# Altium project Handheld Teensy 3.6 Logger Rev3e.PrjPcb
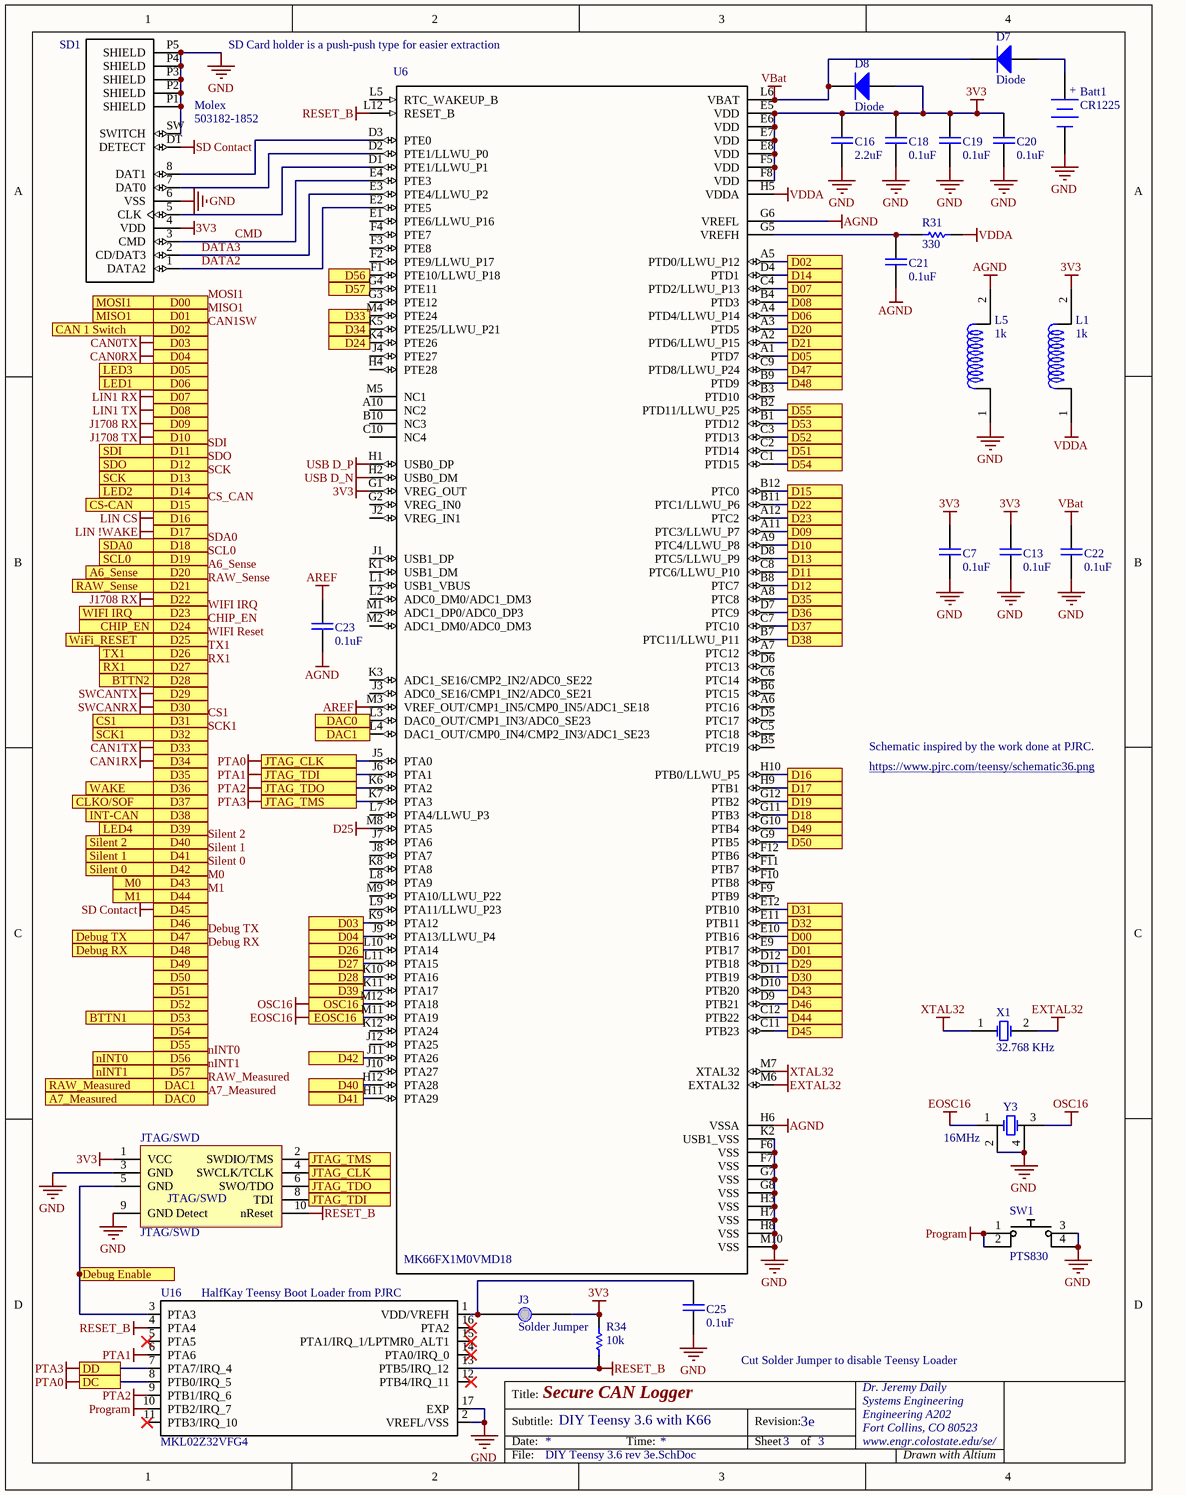
[diagram p0: DIY Teensy 3.6 rev 3e.SchDoc]
3 sheets, 116 parts. Net scope: flat (ports and power ports of the same name join across sheets).
Board file: CAN Logger 3e HP3651 PCB.PcbDoc
Sheets:
  DIY Teensy 3.6 rev 3e.SchDoc
  Teensy 3.6 with J1939 - Handheld Rev3e.SchDoc
  Additional Circuits - Handheld - Rev 3e.SchDoc

## Sheet DIY Teensy 3.6 rev 3e.SchDoc: Secure CAN Logger
size Letter portrait; Organization: Dr. Jeremy Daily; Address1: Systems Engineering; Address2: Engineering A202; Address3: Fort Collins, CO 80523; Address4: www.engr.colostate.edu/se/; DocumentNumber: DIY Teensy 3.6 with K66; Revision: 3e; SheetNumber: 3; SheetTotal: 3

### Parts
Batt1  CR1225  [Battery Clip - CR1225]
C7  0.1uF  [0603]
C13  0.1uF  [0603]
C16  2.2uF  [0603]
C18  0.1uF  [0603]
C19  0.1uF  [0603]
C20  0.1uF  [0603]
C21  0.1uF  [0603]
C22  0.1uF  [0603]
C23  0.1uF  [0603]
C25  0.1uF  [0603]
D7  Diode  [CST2C]
D8  Diode  [CST2C]
J3  Solder Jumper  [Solder Jumper]
JTAG/SWD  JTAG/SWD  [JTAG 10-pin Header]
L1  1k  [0603]
L5  1k  [0603]
R31  330  [0603]
R34  10k  [0603]
SD1  503182-1852  Manufacturer: Molex  [*MOLEX_503182-1852_503182-1852(Primary)]
SW1  PTS830  [Switch PTS830]
U6  MK66FX1M0VMD18  [*BGA144C100P12X12_1300X1300X170_MK66FX1M0VMD18(Primary)]
U16  MKL02Z32VFG4  [*QFN50P300X300X65-17N]
X1  32.768 KHz  [XTAL 2-pad Small]
Y3  16MHz  [XTAL 4 pad]

### Ports
A6_Sense, A7_Measured, BTTN1, BTTN2, CAN 1 Switch, CHIP_EN, CLKO/SOF, CS1, CS-CAN, D00, D01, D02, D03, D04, D05, D06, D07, D08, D09, D10, D11, D12, D13, D14, D15, D16, D17, D18, D19, D20, D21, D22, D23, D24, D25, D26, D27, D28, D29, D30, D31, D32, D33, D34, D35, D36, D37, D38, D39, D40, D41, D42, D43, D44, D45, D46, D47, D48, D49, D50, D51, D52, D53, D54, D55, D56, D57, DAC0, DAC1, DC, DD, Debug Enable, Debug RX, Debug TX, EOSC16, INT-CAN, JTAG_CLK, JTAG_TDI, JTAG_TDO, JTAG_TMS, LED1, LED2, LED3, LED4, M0, M1, MISO1, MOSI1, nINT0, nINT1, OSC16, RAW_Measured, RAW_Sense, RX1, SCK, SCK1, SCL0, SDA0, SDI, SDO, Silent 0, Silent 1, Silent 2, TX1, WAKE, WIFI IRQ, WiFi_RESET

### Nets
3V3: C7.2 C13.2 C16.2 C18.2 C19.2 C20.2 D8.1(A) J3.2 JTAG/SWD.1(VCC) L1.2 R34.1 SD1.4(VDD) U6.E5(VDD) U6.E6(VDD) U6.E7(VDD) U6.E8(VDD) U6.F5(VDD) U6.F8(VDD) U6.G1(VREG_OUT)
AGND: C21.1 C23.1 L5.2 U6.G6(VREFL) U6.H6(VSSA)
AREF: C23.2 U6.M3(VREF_OUT/CMP1_IN5/CMP0_IN5/ADC1_SE18)
CAN0RX: U6.J9(PTA13/LLWU_P4) ; port D04
CAN0TX: U6.K9(PTA12) ; port D03
CAN1RX: U6.K5(PTE25/LLWU_P21) ; port D34
CAN1TX: U6.M4(PTE24) ; port D33
D25: U6.M8(PTA5)
EOSC16: U6.M11(PTA19) Y3.1(OSC1) ; port EOSC16
EXTAL32: U6.M6(EXTAL32) X1.2(OSC2)
GND: Batt1.2(-) C7.1 C13.1 C16.1 C18.1 C19.1 C20.1 C22.1 C25.1 JTAG/SWD.3(GND) JTAG/SWD.9(GND_Detect) L5.1 SD1.6(VSS) SD1.P1(SHIELD) SD1.P2(SHIELD) SD1.P3(SHIELD) SD1.P4(SHIELD) SD1.P5(SHIELD) SD1.SW(SWITCH) SW1.3 SW1.4 U6.F6(VSS) U6.F7(VSS) U6.G7(VSS) U6.G8(VSS) U6.H3(VSS) U6.H7(VSS) U6.H8(VSS) U6.K2(USB1_VSS) U6.M10(VSS) U16.2(VREFL/VSS) U16.17(EXP) Y3.2(OSC2) Y3.4(GND)
J1708 RX: U6.A11(PTC3/LLWU_P7) U6.B11(PTC1/LLWU_P6) ; port D09, port D22
J1708 TX: U6.A9(PTC4/LLWU_P8) ; port D10
LIN1 RX: U6.C4(PTD2/LLWU_P13) ; port D07
LIN1 TX: U6.B4(PTD3) ; port D08
LIN !WAKE: U6.H9(PTB1) ; port D17
LIN CS: U6.H10(PTB0/LLWU_P5) ; port D16
OSC16: U6.M12(PTA18) Y3.3(OSC2) ; port OSC16
Program: SW1.1 SW1.2 U16.10(PTB2/IRQ_7)
PTA0: JTAG/SWD.4(SWCLK/TCLK) U6.J5(PTA0) U16.8(PTB0/IRQ_5) ; port DC, port JTAG_CLK
PTA1: JTAG/SWD.8(TDI) U6.J6(PTA1) U16.6(PTA6) ; port JTAG_TDI
PTA2: JTAG/SWD.6(SWO/TDO) U6.K6(PTA2) U16.9(PTB1/IRQ_6) ; port JTAG_TDO
PTA3: JTAG/SWD.2(SWDIO/TMS) U6.K7(PTA3) U16.7(PTA7/IRQ_4) ; port DD, port JTAG_TMS
RESET_B: JTAG/SWD.10(nReset) R34.2 U6.L12(RESET_B) U16.4(PTA4) U16.13(PTB5/IRQ_12)
SD Contact: SD1.DT(DETECT) U6.C11(PTB23) ; port D45
SWCANRX: U6.D11(PTB19) ; port D30
SWCANTX: U6.D12(PTB18) ; port D29
USB D_N: U6.H2(USB0_DM)
USB D_P: U6.H1(USB0_DP)
VBat: C22.2 D7.2(K) D8.2(K) U6.L6(VBAT)
VDDA: L1.1 R31.1 U6.H5(VDDA)
XTAL32: U6.M7(XTAL32) X1.1(OSC1)
A6_Sense: U6.A3(PTD5) ; port A6_Sense, port D20
A7_Measured: U6.L3(DAC0_OUT/CMP1_IN3/ADC0_SE23) ; port A7_Measured, port DAC0
Blue: U6.K11(PTA17) ; port LED4, port D39
BTTN1: U6.B1(PTD12) ; port BTTN1, port D53
BTTN2: U6.K10(PTA16) ; port BTTN2, port D28
CAN1SW: U6.A5(PTD0/LLWU_P12) ; port CAN 1 Switch, port D02
CHIP_EN: U6.K4(PTE26) ; port CHIP_EN, port D24
CMD: SD1.3(CMD) U6.E4(PTE3)
CS1: U6.E12(PTB10) ; port CS1, port D31
CS_CAN: U6.B12(PTC0) ; port CS-CAN, port D15
DATA2: SD1.1(DATA2) U6.E2(PTE5)
DATA3: SD1.2(CD/DAT3) U6.E3(PTE4/LLWU_P2)
Debug RX: U6.B9(PTD9) ; port Debug RX, port D48
Debug TX: U6.C9(PTD8/LLWU_P24) ; port Debug TX, port D47
Green: U6.A4(PTD4/LLWU_P14) ; port LED1, port D06
M0: U6.D10(PTB20) ; port M0, port D43
M1: U6.C12(PTB22) ; port M1, port D44
MISO1: U6.E9(PTB17) ; port MISO1, port D01
MOSI1: U6.E10(PTB16) ; port MOSI1, port D00
nINT0: U6.F1(PTE10/LLWU_P18) ; port nINT0, port D56
nINT1: U6.G4(PTE11) ; port nINT1, port D57
RAW_Measured: U6.L4(DAC1_OUT/CMP0_IN4/CMP2_IN3/ADC1_SE23) ; port RAW_Measured, port DAC1
RAW_Sense: U6.A2(PTD6/LLWU_P15) ; port RAW_Sense, port D21
RED: U6.D4(PTD1) ; port LED2, port D14
RX1: U6.L11(PTA15) ; port RX1, port D27
SCK: U6.D8(PTC5/LLWU_P9) ; port SCK, port D13
SCK1: U6.E11(PTB11) ; port SCK1, port D32
SCL0: U6.G12(PTB2) ; port SCL0, port D19
SDA0: U6.G11(PTB3) ; port SDA0, port D18
SDI: U6.C8(PTC6/LLWU_P10) ; port SDI, port D11
SDO: U6.B8(PTC7) ; port SDO, port D12
Silent 0: U6.J11(PTA26) ; port Silent 0, port D42
Silent 1: U6.H11(PTA29) ; port Silent 1, port D41
Silent 2: U6.H12(PTA28) ; port Silent 2, port D40
TX1: U6.L10(PTA14) ; port TX1, port D26
WIFI IRQ: U6.A12(PTC2) ; port WIFI IRQ, port D23
WIFI Reset: port WiFi_RESET, port D25
Yellow: U6.A1(PTD7) ; port LED3, port D05
NetBatt1_1: Batt1.1(+) D7.1(A)
NetC21_2: C21.2 R31.2 U6.G5(VREFH)
NetC25_2: C25.2 J3.1 U16.1(VDD/VREFH)
NetJTAG/SWD_5: JTAG/SWD.5(GND) U16.3(PTA3) ; port Debug Enable
NetSD1_5: SD1.5(CLK) U6.D1(PTE1/LLWU_P1)
NetSD1_7: SD1.7(DAT0) U6.D2(PTE1/LLWU_P0)
NetSD1_8: SD1.8(DAT1) U6.D3(PTE0)
NetU6_A8: U6.A8(PTC8) ; port D35
NetU6_B2: U6.B2(PTD11/LLWU_P25) ; port D55
NetU6_B7: U6.B7(PTC11/LLWU_P11) ; port INT-CAN, port D38
NetU6_C1: U6.C1(PTD15) ; port D54
NetU6_C2: U6.C2(PTD14) ; port D51
NetU6_C3: U6.C3(PTD13) ; port D52
NetU6_C7: U6.C7(PTC10) ; port CLKO/SOF, port D37
NetU6_D7: U6.D7(PTC9) ; port WAKE, port D36
NetU6_D9: U6.D9(PTB21) ; port D46
NetU6_G9: U6.G9(PTB5) ; port D50
NetU6_G10: U6.G10(PTB4) ; port D49

Not connected (* = marked no-connect by the designer): U6 A6(PTC16) A7(PTC12) A10(NC2) B3(PTD10) B5(PTC19) B6(PTC15) B10(NC3) C5(PTC18) C6(PTC14) C10(NC4) D5(PTC17) D6(PTC13) E1(PTE6/LLWU_P16) F2(PTE9/LLWU_P17) F3(PTE8) F4(PTE7) F9(PTB9) F10(PTB8) F11(PTB7) F12(PTB6) G2(VREG_IN0) G3(PTE12) H4(PTE28) J1(USB1_DP) J2(VREG_IN1) J3(ADC0_SE16/CMP1_IN2/ADC0_SE21) J4(PTE27) J7(PTA6) J8(PTA7) J10(PTA27) J12(PTA25) K1(USB1_DM) K3(ADC1_SE16/CMP2_IN2/ADC0_SE22) K8(PTA8) K12(PTA24) L1(USB1_VBUS) L2(ADC0_DM0/ADC1_DM3) L5(RTC_WAKEUP_B) L7(PTA4/LLWU_P3) L8(PTA9) L9(PTA11/LLWU_P23) M1(ADC1_DP0/ADC0_DP3) M2(ADC1_DM0/ADC0_DM3) M5(NC1) M9(PTA10/LLWU_P22); U16 5(PTA5)* 11(PTB3/IRQ_10)* 12(PTB4/IRQ_11)* 14(PTA0/IRQ_0)* 15(PTA1/IRQ_1/LPTMR0_ALT1)* 16(PTA2)*

### Notes on the sheet
- SD Card holder is a push-push type for easier extraction
- Schematic inspired by the work done at PJRC.
- https://www.pjrc.com/teensy/schematic36.png
- (near U16) HalfKay Teensy Boot Loader from PJRC
- Cut Solder Jumper to disable Teensy Loader
- Title:
- Subtitle:
- Date:
- Time:
- Revision:
- Sheet
- of
- File:
- Drawn with Altium

### Library data of the parts
Batt1 = CR2032 Battery Holder: Lithium Battery Non-Rechargeable (Primary) 3V Coin, 12.5mm; Manufacturer: Linx; PartNumber: BAT-HLD-012-SMT; Supplier 1: Digi-Key; Supplier Part Number 1: BAT-HLD-012-SMT-ND
C7 C13 C18-C23 C25 = Cap: CAP CER 0.1UF 50V X7R 0603; Manufacturer: KEMET; PartNumber: C0603C104K5RACAUTO; Alternative: Acceptable; Supplier 1: Digi-Key; Supplier Part Number 1: 399-6856-1-ND
C16 = Cap: 2.2µF ±10% 6.3V Ceramic Capacitor X5R 0603 (1608 Metric); Manufacturer: Taiyo Yuden; PartNumber: JMK107BJ225KAHT; Alternative: Acceptable; Supplier 1: Digi-Key; Supplier Part Number 1: 587-3386-1-ND
D7 D8 = Diode: Default Diode; Manufacturer: Toshiba Semiconductor and Storage; PartNumber: CCS15S30L3FCT-ND; Supplier 1: Digi-Key; Supplier Part Number 1: CCS15S30L3FCT-ND
JTAG/SWD = JTAG Cortex: Connector Header Surface Mount 10 position 0.050" (1.27mm); Manufacturer: CNC Tech; PartNumber: 3221-10-0300-00; Supplier 1: Digi-Key; Supplier Part Number 1: 1175-1735-ND
L1 L5 = Ferrite Bead: 1 kOhms @ 100MHz 1 Power Line Ferrite Bead 0603 (1608 Metric) 1A 200mOhm; Manufacturer: Murata; PartNumber: BLM18KG102SN1D; Alternative: Acceptable; Supplier 1: Digi-Key; Supplier Part Number 1: 490-17349-1-ND
R31 = Chip Resistor: 330 Ohms ±1% 0.1W, 1/10W Chip Resistor 0603 (1608 Metric) Automotive AEC-Q200, High Voltage Thick Film; Manufacturer: Rohm Semiconductor; PartNumber: KTR03EZPF3300; Alternative: Acceptable; Supplier 1: Digi-Key; Supplier Part Number 1: RHM330AYCT-ND
R34 = Chip Resistor: 10 kOhms ±1% 0.1W, 1/10W Chip Resistor 0603 (1608 Metric) Automotive AEC-Q200, High Voltage Thick Film; Manufacturer: Rohm Semiconductor; PartNumber: KTR03EZPF1002; Alternative: Acceptable; Supplier 1: Digi-Key; Supplier Part Number 1: RHM10.0KAYCT-ND
SD1 = 503182-1852: MICRO SD NORMAL ULTRALOWPRO8CKTE; PartNumber: 5031821852; Supplier Part Number 1: WM12834CT-ND; Supplier 1: Digi-Key
SW1 = Switch - Tactile_2: Tactile Switch SPST-NO Top Actuated Surface Mount; Manufacturer: C & K Components; PartNumber: PTS830GM140 SMTR LFS; Supplier 1: Digi-Key; Supplier Part Number 1: CKN10587CT-ND
U6 = MK66FX1M0VMD18: Kinetis K66: 180MHz Cortex-M4F MCU, 1.2MB Flash, 256KB SRAM, 2xUSB, Ethernet, 144-MAPBGA; Manufacturer: NXP USA Inc.; PartNumber: MK66FX1M0VMD18; Supplier 1: Digi-Key; Supplier Part Number 1: 568-13335-ND
U16 = MKL02Z32VFG4: 32 Bit Microcontroller, Kinetis L Series Ultra Low Power, ARM Cortex-M0+, 48 MHz, 32 KB, 4 KB, 16; Manufacturer: PJRC; PartNumber: Pre Programmed MKL02Z32VFG4; Alternative: Sole Source; Supplier 1: PJRC; Supplier Part Number 1: IC_MKL02Z32_QFN16
X1 = Crystal Oscillator: Canned Oscillator; Manufacturer: ECS Inc.; PartNumber: ECS-.327-CDX-1128; Supplier 1: Digi-Key; Supplier Part Number 1: XC2190CT-ND
Y3 = Crystal with Ground: 16MHz ±30ppm Crystal 18pF 80 Ohms 4-SMD, No Lead; Manufacturer: ECS Inc.; PartNumber: XC2866CT-ND; Supplier Part Number 1: XC2866CT-ND; Supplier 1: Digi-Key

## Sheet Teensy 3.6 with J1939 - Handheld Rev3e.SchDoc: Secure CAN Logger
size Letter; Organization: Dr. Jeremy Daily; Address1: Systems Engineering; Address2: Engineering A202; Address3: Fort Collins , CO 80523; Address4: www.engr.colostate.edu/se/; DocumentNumber: External Connections; Revision: 3e; SheetNumber: 1; SheetTotal: 3
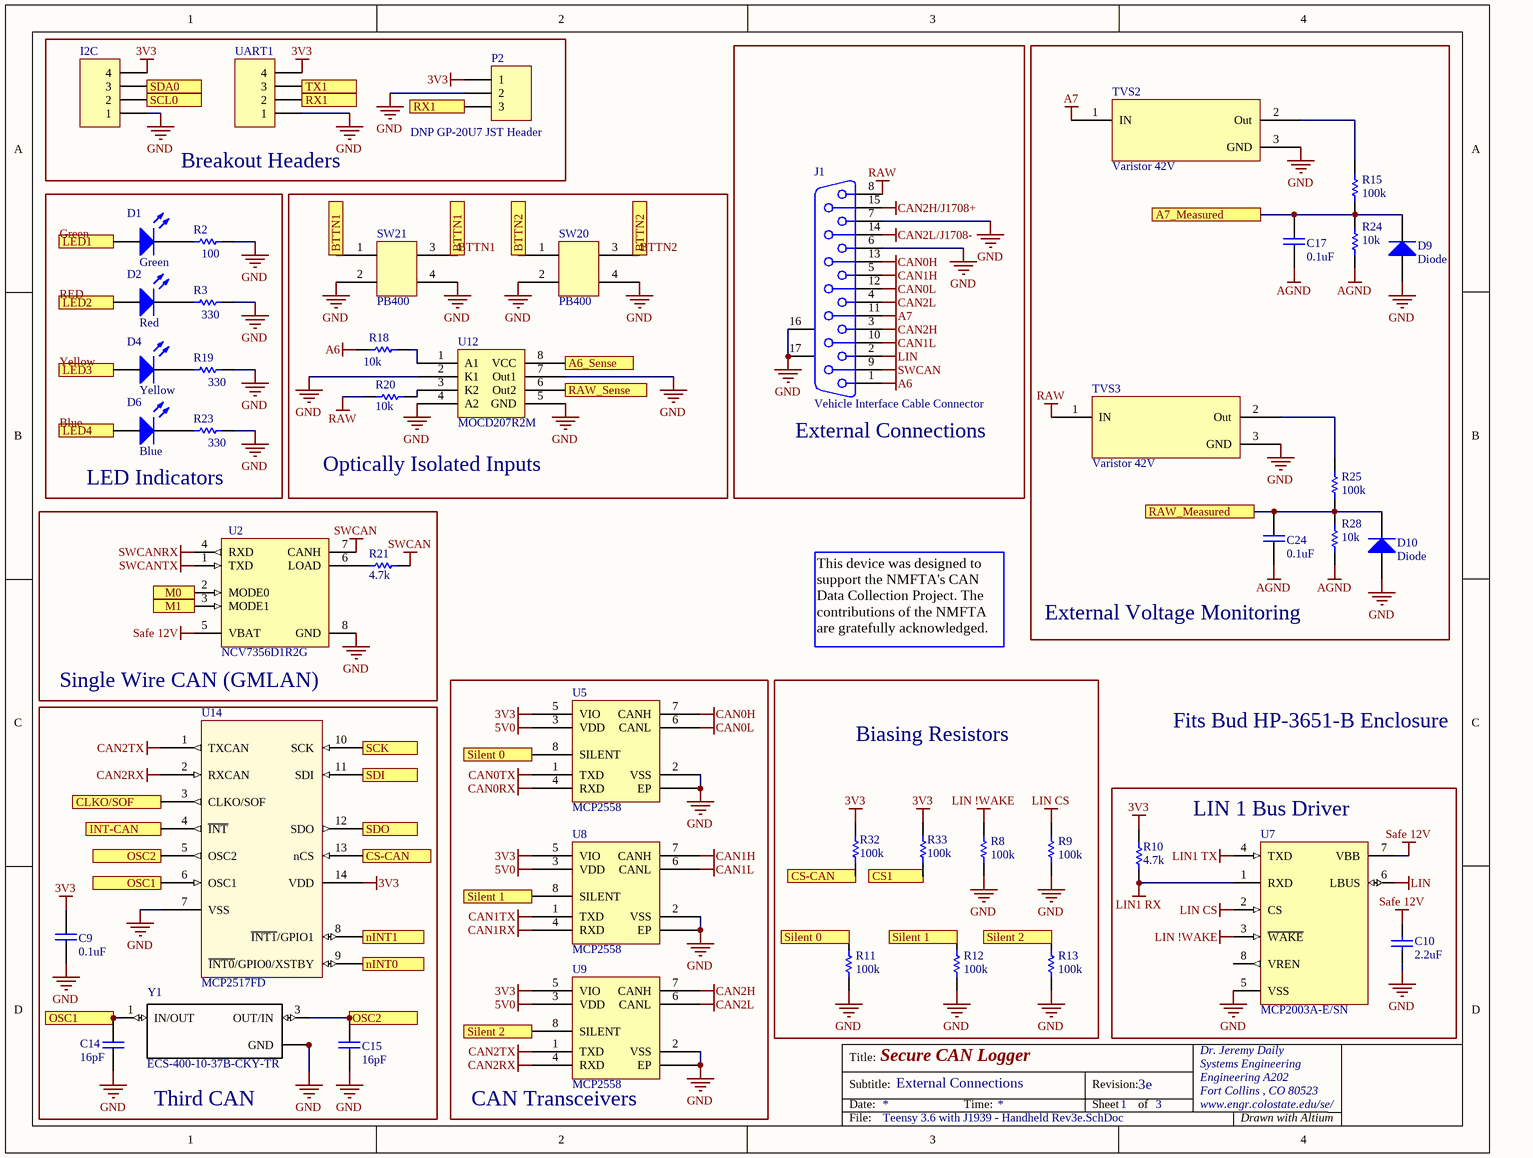
[diagram p1: Teensy 3.6 with J1939 - Handheld Rev3e.SchDoc]

### Parts
C9  0.1uF  [0603]
C10  2.2uF  [0603]
C14  16pF  [0603]
C15  16pF  [0603]
C17  0.1uF  [0603]
C24  0.1uF  [0603]
D1  Green  [0805 Polarized]
D2  Red  [0805 Polarized]
D4  Yellow  [0805 Polarized]
D6  Blue  [0805 Polarized]
D9  Diode  [CST2C]
D10  Diode  [CST2C]
I2C  Header 4  [HDR1X4]  (value not drawn)
J1  Vehicle Interface Cable Connector  [DSUB1.385-2H15]
P2  DNP GP-20U7 JST Header  [MHDR1X3]
R2  100  [0603]
R3  330  [0603]
R8  100k  [0603]
R9  100k  [0603]
R10  4.7k  [0603]
R11  100k  [0603]
R12  100k  [0603]
R13  100k  [0603]
R15  100k  [0603]
R18  10k  [0603]
R19  330  [0603]
R20  10k  [0603]
R21  4.7k  [0603]
R23  330  [0603]
R24  10k  [0603]
R25  100k  [0603]
R28  10k  [0603]
R32  100k  [0603]
R33  100k  [0603]
SW20  PB400  [PB400]
SW21  PB400  [PB400]
TVS2  Varistor 42V  [Transfeed]
TVS3  Varistor 42V  [Transfeed]
U2  NCV7356D1R2G  [ONSC-SOIC-8-751-07_V]
U5  MCP2558  [TDFN]
U7  MCP2003A-E/SN  [SOIC-SN8_N]
U8  MCP2558  [TDFN]
U9  MCP2558  [TDFN]
U12  MOCD207R2M  [SOIC-8]
U14  MCP2517FD  [SOP14]
UART1  Header 4  [HDR1X4]  (value not drawn)
Y1  ECS-400-10-37B-CKY-TR  [*XTAL_ECS-160-9-37-CKM-TR]

### Blocks framed on the sheet
Breakout Headers: I2C P2 UART1
External Connections: J1
External Voltage Monitoring: C17 C24 D9 D10 R15 R24 R25 R28 TVS2 TVS3
LED Indicators: D1 D2 D4 D6 R2 R3 R19 R23
Optically Isolated Inputs: R18 R20 SW20 SW21 U12
Single Wire CAN (GMLAN): R21 U2
CAN Transceivers: U5 U8 U9
Biasing Resistors: R8 R9 R11-R13 R32 R33
Third CAN: C9 C14 C15 U14 Y1
LIN 1 Bus Driver: C10 R10 U7

### Ports
A6_Sense, A7_Measured, BTTN1, BTTN2, CLKO/SOF, CS1, CS-CAN, INT-CAN, LED1, LED2, LED3, LED4, M0, M1, nINT0, nINT1, OSC1, OSC2, RAW_Measured, RAW_Sense, RX1, SCK, SCL0, SDA0, SDI, SDO, Silent 0, Silent 1, Silent 2, TX1

### Nets
3V3: C9.2 I2C.4 P2.1 R10.2 R32.2 R33.2 U5.5(VIO) U8.5(VIO) U9.5(VIO) U14.14(VDD) UART1.4
5V0: U5.3(VDD) U8.3(VDD) U9.3(VDD)
A6: J1.1 R18.1
A7: J1.11 TVS2.1(IN)
AGND: C17.1 C24.1 R24.2 R28.2
CAN0H: J1.13 U5.7(CANH)
CAN0L: J1.12 U5.6(CANL)
CAN0RX: U5.4(RXD)
CAN0TX: U5.1(TXD)
CAN1H: J1.5 U8.7(CANH)
CAN1L: J1.10 U8.6(CANL)
CAN1RX: U8.4(RXD)
CAN1TX: U8.1(TXD)
CAN2H: J1.3 U9.7(CANH)
CAN2H/J1708+: J1.15
CAN2L: J1.4 U9.6(CANL)
CAN2L/J1708-: J1.14
CAN2RX: U9.4(RXD) U14.2(RXCAN)
CAN2TX: U9.1(TXD) U14.1(TXCAN)
GND: C9.1 C10.2 C14.1 C15.1 D9.1(A) D10.1(A) I2C.1 J1.6 J1.7 J1.16(MH1) J1.17(MH2) P2.2 R2.2 R3.2 R8.2 R9.2 R11.2 R12.2 R13.2 R19.2 R23.2 SW20.2 SW20.4 SW21.2 SW21.4 TVS2.3(GND) TVS3.3(GND) U2.8(GND) U5.0(EP) U5.2(VSS) U7.5(VSS) U8.0(EP) U8.2(VSS) U9.0(EP) U9.2(VSS) U12.2(K1) U12.4(A2) U12.5(GND) U12.7(Out1) U14.7(VSS) UART1.1 Y1.2(GND) Y1.4(GND)
LIN: J1.2 U7.6(LBUS)
LIN1 RX: R10.1 U7.1(RXD)
LIN1 TX: U7.4(TXD)
LIN !WAKE: R8.1 U7.3(~{WAKE})
LIN CS: R9.1 U7.2(CS)
RAW: J1.8 R20.1 TVS3.1(IN)
Safe 12V: C10.1 U2.5(VBAT) U7.7(VBB)
SWCAN: J1.9 R21.2 U2.7(CANH)
SWCANRX: U2.4(RXD)
SWCANTX: U2.1(TXD)
A6_Sense: U12.8(VCC) ; port A6_Sense
A7_Measured: C17.2 D9.2(K) R15.2 R24.1 ; port A7_Measured
Blue: D6.1(A) ; port LED4
BTTN1: SW21.1 SW21.3 ; port BTTN1
BTTN2: SW20.1 SW20.3 ; port BTTN2
CS1: R33.1 ; port CS1
CS_CAN: R32.1 U14.13(nCS) ; port CS-CAN
Green: D1.1(A) ; port LED1
M0: U2.2(MODE0) ; port M0
M1: U2.3(MODE1) ; port M1
nINT0: U14.9(~{INT0}/GPIO0/XSTBY) ; port nINT0
nINT1: U14.8(~{INT1}/GPIO1) ; port nINT1
RAW_Measured: C24.2 D10.2(K) R25.2 R28.1 ; port RAW_Measured
RAW_Sense: U12.6(Out2) ; port RAW_Sense
RED: D2.1(A) ; port LED2
RX1: P2.3 UART1.2 ; port RX1
SCK: U14.10(SCK) ; port SCK
SCL0: I2C.2 ; port SCL0
SDA0: I2C.3 ; port SDA0
SDI: U14.11(SDI) ; port SDI
SDO: U14.12(SDO) ; port SDO
Silent 0: R11.1 U5.8(SILENT) ; port Silent 0
Silent 1: R12.1 U8.8(SILENT) ; port Silent 1
Silent 2: R13.1 U9.8(SILENT) ; port Silent 2
TX1: UART1.3 ; port TX1
Yellow: D4.1(A) ; port LED3
NetC14_2: C14.2 U14.6(OSC1) Y1.1(IN/OUT) ; port OSC1
NetC15_2: C15.2 U14.5(OSC2) Y1.3(OUT/IN) ; port OSC2
NetD1_2: D1.2(K) R2.1
NetD2_2: D2.2(K) R3.1
NetD4_2: D4.2(K) R19.1
NetD6_2: D6.2(K) R23.1
NetR15_1: R15.1 TVS2.2(Out)
NetR18_2: R18.2 U12.1(A1)
NetR20_2: R20.2 U12.3(K2)
NetR21_1: R21.1 U2.6(LOAD)
NetR25_1: R25.1 TVS3.2(Out)
NetU6_B7: U14.4(~{INT}) ; port INT-CAN
NetU6_C7: U14.3(CLKO/SOF) ; port CLKO/SOF

Not connected (* = marked no-connect by the designer): U7 8(VREN)

### Notes on the sheet
- This device was designed to support the NMFTA's CAN Data Collection Project. The contributions of the NMFTA are gratefully acknowledged.
- Fits Bud HP-3651-B Enclosure
- Title:
- Subtitle:
- Date:
- Time:
- Revision:
- Sheet
- of
- File:
- Drawn with Altium

### Library data of the parts
C9 C17 C24 = Cap: as C7 on sheet DIY Teensy 3.6 rev 3e; Supplier 1: Digi-Key; Supplier Part Number 1: 399-6856-1-ND
C10 = Cap: as C16 on sheet DIY Teensy 3.6 rev 3e; Supplier 1: Digi-Key; Supplier Part Number 1: 587-3386-1-ND
C14 C15 = Cap: 16pF ±5% 50V Ceramic Capacitor C0G, NP0 0603 (1608 Metric); Manufacturer: Yageo; PartNumber: CC0603JRNPO9BN160; Alternative: Acceptable; Supplier 1: Digi-Key; Supplier Part Number 1: 311-3964-1-ND
D1 = LED - SMD: Green 570nm LED Indication - Discrete 2.2V 0805 (2012 Metric); Manufacturer: OSRAM Opto Semiconductors Inc.; PartNumber: LG R971-KN-1; Supplier 1: Digi-Key; Supplier Part Number 1: 475-1410-1-ND
D2 = LED - SMD: Red 633nm LED Indication - Discrete 2V 0805 (2012 Metric); Manufacturer: OSRAM Opto Semiconductors Inc.; PartNumber: LS R976-NR-1; Supplier 1: Digi-Key; Supplier Part Number 1: 475-1278-1-ND
D4 = LED - SMD: LED YELLOW DIFFUSED 0805 SMD; Manufacturer: OSRAM Opto Semiconductors Inc.; PartNumber: LY R976-PS-36; Supplier 1: Digi-Key; Supplier Part Number 1: 475-2560-1-ND
D6 = LED - SMD: Blue 470nm LED Indication - Discrete 3.3V 0805 (2012 Metric); Manufacturer: Broadcom Limited; PartNumber: HSMN-C170; Supplier 1: Digi-Key; Supplier Part Number 1: 516-1437-1-ND
D9 D10 = Diode: as D7 on sheet DIY Teensy 3.6 rev 3e; Supplier 1: Digi-Key; Supplier Part Number 1: CCS15S30L3FCT-ND
I2C UART1 = Header 4: Header, 4-Pin
J1 = D Connector 15: Receptacle Assembly, 15 Position, Right Angle; Manufacturer: Amphenol FCI; PartNumber: D15S33E4GV00LF; Supplier 1: Digi-Key; Supplier Part Number 1: 609-1498-ND
P2 = MHDR1X3: CONN HEADER PH SIDE 3POS 2MM SMD; PartNumber: S3B-PH-SM4-TB(LF)(SN); Manufacturer: JST; Supplier 1: Digi-Key; Supplier Part Number 1: 455-1750-1-ND
R2 = Chip Resistor: 100 Ohms ±1% 0.1W, 1/10W Chip Resistor 0603 (1608 Metric) Automotive AEC-Q200, High Voltage Thick Film; Manufacturer: Rohm Semiconductor; PartNumber: KTR03EZPF1000; Alternative: Acceptable; Supplier 1: Digi-Key; Supplier Part Number 1: RHM100AYCT-ND
R3 R19 R23 = Chip Resistor: as R31 on sheet DIY Teensy 3.6 rev 3e; Supplier 1: Digi-Key; Supplier Part Number 1: RHM330AYCT-ND
R8 R9 R11-R13 R15 R25 R32 R33 = Chip Resistor: 100 kOhms ±1% 0.1W, 1/10W Chip Resistor 0603 (1608 Metric) Automotive AEC-Q200, High Voltage Thick Film; Manufacturer: Rohm Semiconductor; PartNumber: KTR03EZPF1003; Alternative: Acceptable; Supplier 1: Digi-Key; Supplier Part Number 1: RHM100KAYCT-ND
R10 R21 = Chip Resistor: 4.7 kOhms ±1% 0.1W, 1/10W Chip Resistor 0603 (1608 Metric) Automotive AEC-Q200, High Voltage Thick Film; Manufacturer: Rohm Semiconductor; PartNumber: KTR03EZPF4701; Alternative: Acceptable; Supplier 1: Digi-Key; Supplier Part Number 1: RHM4.7KAYCT-ND
R18 R20 R24 R28 = Chip Resistor: as R34 on sheet DIY Teensy 3.6 rev 3e; Supplier 1: Digi-Key; Supplier Part Number 1: RHM10.0KAYCT-ND
SW20 SW21 = PB400: Pushbutton Switch DPST-NO Standard Through Hole, Right Angle; Manufacturer: E-Switch; PartNumber: PB400OAQR1BLK; Supplier 1: Digi-Key; Supplier Part Number 1: EG5548-ND
TVS2 TVS3 = Transfeed: VARISTOR CAP FEEDTHRU 18V 0805; Manufacturer: AVX; PartNumber: V2F118A400Y2EDP; Supplier 1: Digi-Key; Supplier Part Number 1: 478-2485-1-ND
U2 = NCV7356D1G: Single Wire CAN Transceiver, 5 to 27 V, 8-Pin SOIC, Pb-Free, Tube; Manufacturer: On Semiconductor; Supplier 1: Digi-Key; Supplier Part Number 1: NCV7356D1R2GOSCT-ND; PartNumber: NCV7356D1R2G
U5 = MCP2558FD: Microchip CAN FD Transceiver with Silent Mode; Manufacturer: Microchip Technology; PartNumber: MCP2558FDT-H/MNY; Supplier 1: Digi-Key; Supplier Part Number 1: MCP2558FDT-H/MNYCT-ND
U7 = MCP2003AT-E/SN: LIN J2602 Transceiver, 8-Pin SOIC, Extended Temperature, Tape and Reel; Manufacturer: Microchip Technology; Supplier 1: Digi-Key; Supplier Part Number 1: MCP2003A-E/SN-ND; PartNumber: MCP2003A-E/SN
U8 U9 = MCP2558FD: Microchip CAN FD Transceiver with Silent Mode; PartNumber: MCP2558FDT-H/MNY; Manufacturer: Microchip; Supplier 1: Digi-Key; Supplier Part Number 1: MCP2558FDT-H/MNYCT-ND
U12 = Optoisolator - Dual: Optoisolator Transistor Output 2500Vrms 2 Channel 8-SO Tall; Manufacturer: Fairchild/ON Semiconductor; PartNumber: MOCD207R2M; Supplier 1: Digi-Key; Supplier Part Number 1: MOCD207R2MCT-ND
U14 = MCP2517FD: CANbus Controller CAN 2.0 SPI Interface 14-VDFN (4.5x3); Manufacturer: Microchip Technology; PartNumber: MCP2517FDT-H/JHA; Supplier 1: Digi-Key; Supplier Part Number 1: MCP2517FDT-H/JHACT-ND
Y1 = ECS-400-10-37B-CKY-TR: Manufacturer: ECS Inc.; PartNumber: ECS-400-10-37B-CKY-TR; Supplier 1: Digi-Key; Supplier Part Number 1: XC3069CT-ND

## Sheet Additional Circuits - Handheld - Rev 3e.SchDoc: Secure Handheld J1939 Logger
size Letter; Organization: Dr. Jeremy Daily; Address1: Systems Engineering; Address2: Engineering A202; Address3: Fort Collins, CO 80523; Address4: www.engr.colostate.edu/se/; DocumentNumber: Wifi, J1708, USB, and Security; Revision: 3e; SheetNumber: 2; SheetTotal: 3
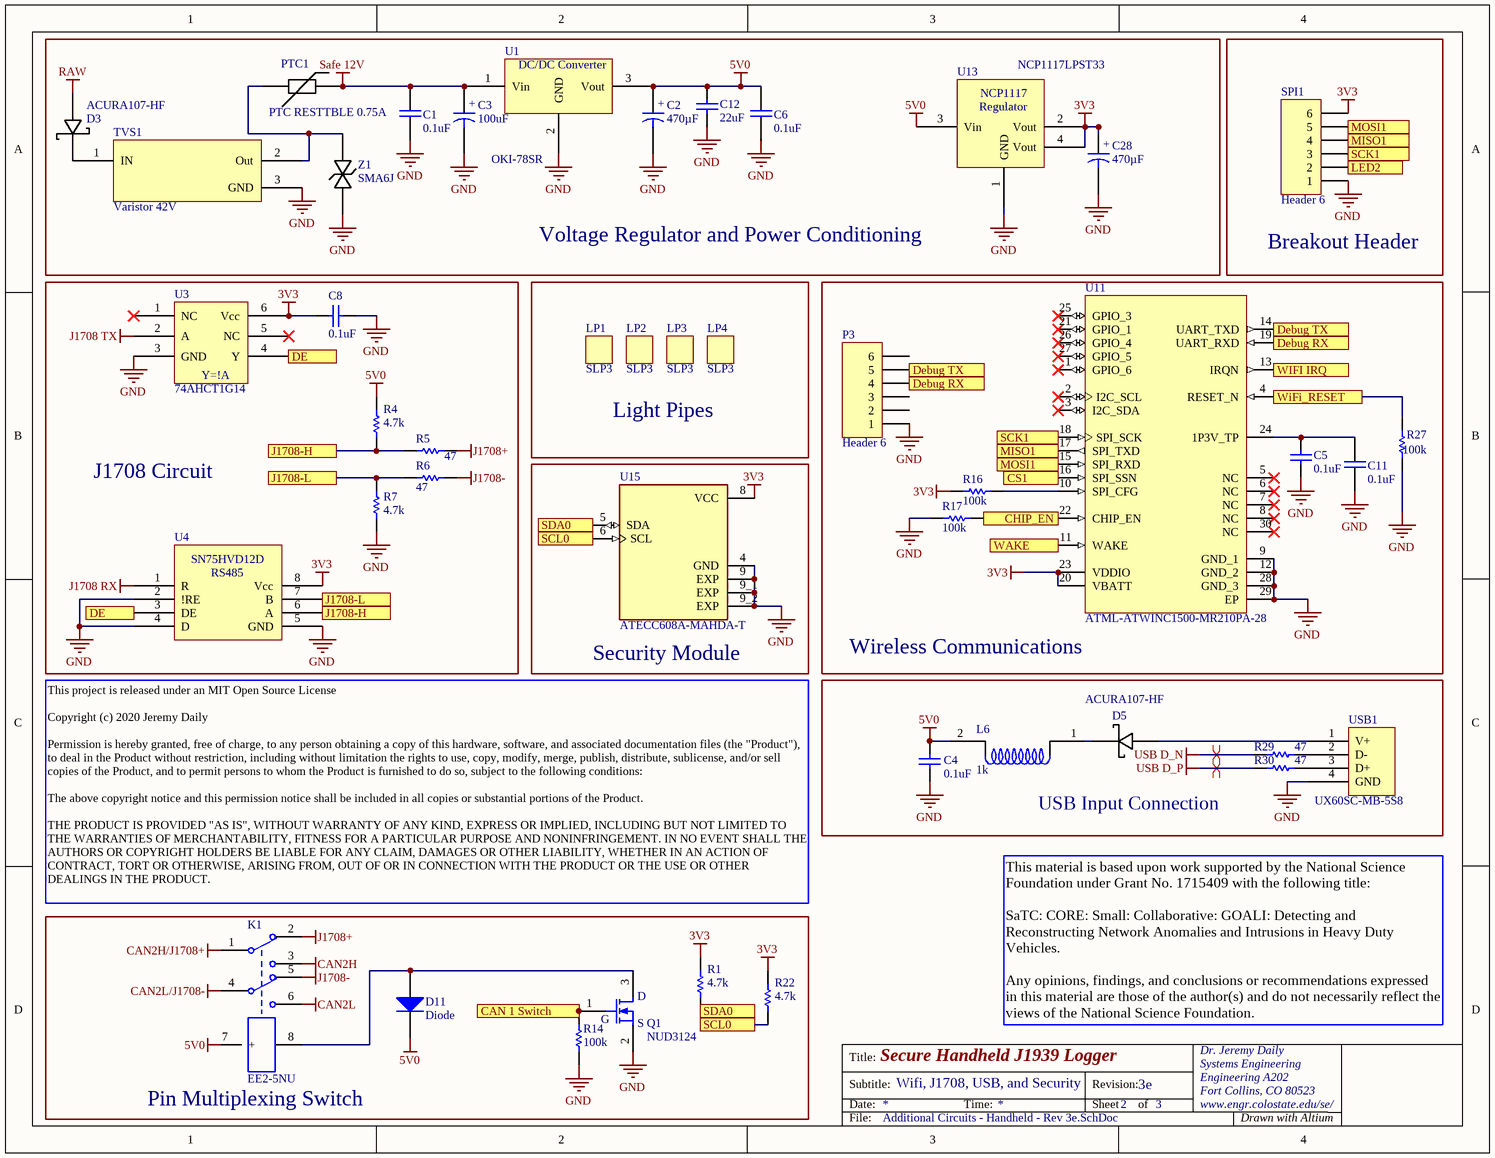
[diagram p2: Additional Circuits - Handheld - Rev 3e.SchDoc]

### Parts
C1  0.1uF  [0603]
C2  470µF  [Elec. Cap - G]
C3  100uF  [Elec. Cap - G]
C4  0.1uF  [0603]
C5  0.1uF  [0603]
C6  0.1uF  [0603]
C8  0.1uF  [0603]
C11  0.1uF  [0603]
C12  22uF  [1206]
C28  470µF  [Elec. Cap - G]
D3  ACURA107-HF  [SMA with A and K]
D5  ACURA107-HF  [SMA with A and K]
D11  Diode  [CST2C]
K1  EE2-5NU  [RELAY - EE2]
L6  1k  [0603]
LP1  SLP3  [PCBComponent_1]
LP2  SLP3  [PCBComponent_1]
LP3  SLP3  [PCBComponent_1]
LP4  SLP3  [PCBComponent_1]
P3  Header 6  [HDR1X6]
PTC1  PTC RESTTBLE 0.75A  [1812]
Q1  NUD3124  [SOT23_N]
R1  4.7k  [0603]
R4  4.7k  [0603]
R5  47  [0603]
R6  47  [0603]
R7  4.7k  [0603]
R14  100k  [0603]
R16  100k  [0603]
R17  100k  [0603]
R22  4.7k  [0603]
R27  100k  [0603]
R29  47  [0603]
R30  47  [0603]
SPI1  Header 6  [HDR1X6]
TVS1  Varistor 42V  [Transfeed]
U1  OKI-78SR  [OKI-78SR]
U3  74AHCT1G14  [SOT-353]
U4  SN75HVD08DR  [SOIC-SN8_N]  (value not drawn)
U11  ATML-ATWINC1500-MR210PA-28  [ATML-ATWINC1500-MR210PA-28_V]
U13  NCP1117LPST33  [SOT-223]
U15  ATECC608A-MAHDA-T  [SON50P200X300X60-9N]
USB1  UX60SC-MB-5S8  [USB Mini UX60S]
Z1  SMA6J  [SMA]

### Blocks framed on the sheet
Voltage Regulator and Power Conditioning: C1-C3 C6 C12 C28 D3 PTC1 TVS1 U1 U13 Z1
Breakout Header: SPI1
J1708 Circuit: C8 R4-R7 U3 U4
Light Pipes: LP1-LP4
Wireless Communications: C5 C11 P3 R16 R17 R27 U11
Security Module: U15
USB Input Connection: C4 D5 L6 R29 R30 USB1
Pin Multiplexing Switch: D11 K1 Q1 R1 R14 R22

### Ports
CAN 1 Switch, CHIP_EN, CS1, DE, Debug RX, Debug TX, J1708-H, J1708-L, LED2, MISO1, MOSI1, SCK1, SCL0, SDA0, WAKE, WIFI IRQ, WiFi_RESET

### Nets
3V3: C8.2 C28.1 R1.1 R16.2 R22.1 SPI1.6 U3.6(Vcc) U4.8(Vcc) U11.20(VBATT) U11.23(VDDIO) U13.2(Vout) U13.4(Vout) U15.8(VCC)
5V0: C2.1 C4.1 C6.2 C12.2 D11.2(K) K1.7(+) L6.2 R4.1 U1.3(Vout) U13.3(Vin)
CAN2H: K1.3
CAN2H/J1708+: K1.1(COM1)
CAN2L: K1.6
CAN2L/J1708-: K1.4
GND: C1.1 C2.2(-) C3.2(-) C4.2 C5.1 C6.1 C8.1 C11.1 C12.1 C28.2(-) P3.1 Q1.2(Source) R7.2 R14.1 R17.2 R27.2 SPI1.1 TVS1.3(GND) U1.2(GND) U3.3(GND) U4.2(!RE) U4.4(D) U4.5(GND) U11.9(GND_1) U11.12(GND_2) U11.28(GND_3) U11.29(EP) U13.1(GND) U15.4(GND) U15.9(EXP) U15.9_1(EXP) U15.9_2(EXP) USB1.4(GND) Z1.1(A)
J1708 RX: U4.1(R)
J1708 TX: U3.2(A)
J1708+: K1.2 R5.2
J1708-: K1.5 R6.2
RAW: D3.1(A)
Safe 12V: C1.2 C3.1 PTC1.2 U1.1(Vin)
USB D_N: R29.1
USB D_P: R30.1
CAN1SW: Q1.1(Gate) R14.2 ; port CAN 1 Switch
CHIP_EN: R17.1 U11.22(CHIP_EN) ; port CHIP_EN
CS1: U11.16(SPI_SSN) ; port CS1
Debug RX: P3.4 U11.19(UART_RXD) ; port Debug RX
Debug TX: P3.5 U11.14(UART_TXD) ; port Debug TX
MISO1: SPI1.4 U11.17(SPI_TXD) ; port MISO1
MOSI1: SPI1.5 U11.15(SPI_RXD) ; port MOSI1
RED: SPI1.2 ; port LED2
SCK1: SPI1.3 U11.18(SPI_SCK) ; port SCK1
SCL0: R22.2 U15.6(SCL) ; port SCL0
SDA0: R1.2 U15.5(SDA) ; port SDA0
WIFI IRQ: U11.13(IRQN) ; port WIFI IRQ
WIFI Reset: R27.1 U11.4(RESET_N) ; port WiFi_RESET
NetC5_2: C5.2 C11.2 U11.24(1P3V_TP)
NetD3_2: D3.2(K) TVS1.1(IN)
NetD5_1: D5.1(A) USB1.1(V+)
NetD5_2: D5.2(K) L6.1
NetD11_1: D11.1(A) K1.8(-) Q1.3(Drain)
NetPTC1_1: PTC1.1 TVS1.2(Out) Z1.2(K)
NetR4_2: R4.2 R5.1 U4.6(A) ; port J1708-H
NetR6_1: R6.1 R7.1 U4.7(B) ; port J1708-L
NetR16_1: R16.1 U11.10(SPI_CFG)
NetR29_2: R29.2 USB1.2(D-)
NetR30_2: R30.2 USB1.3(D+)
NetU3_4: U3.4(Y) U4.3(DE) ; port DE
NetU6_D7: U11.11(WAKE) ; port WAKE

Not connected (* = marked no-connect by the designer): P3 2 3 6; U3 1(NC)* 5(NC)*; U11 1(GPIO_6)* 2(I2C_SCL)* 3(I2C_SDA)* 5(NC)* 6(NC)* 7(NC)* 8(NC)* 21(GPIO_1)* 25(GPIO_3)* 26(GPIO_4)* 27(GPIO_5)* 30(NC)*

### Layout directives
differential pair: USB D_N, USB D_P

### Notes on the sheet
- This project is released under an MIT Open Source License
  Copyright (c) 2020 Jeremy Daily
  Permission is hereby granted, free of charge, to any person obtaining a copy of this hardware, software, and associated documentation files (the "Product"), to deal in the Product without restriction, including without limitation the rights to use, copy, modify, merge, publish, distribute, sublicense, and/or sell copies of the Product, and to permit persons to whom the Product is furnished to do so, subject to the following conditions:
  The above copyright notice and this permission notice shall be included in all copies or substantial portions of the Product.
  THE PRODUCT IS PROVIDED "AS IS", WITHOUT WARRANTY OF ANY KIND, EXPRESS OR IMPLIED, INCLUDING BUT NOT LIMITED TO THE WARRANTIES OF MERCHANTABILITY, FITNESS FOR A PARTICULAR PURPOSE AND NONINFRINGEMENT. IN NO EVENT SHALL THE AUTHORS OR COPYRIGHT HOLDERS BE LIABLE FOR ANY CLAIM, DAMAGES OR OTHER LIABILITY, WHETHER IN AN ACTION OF CONTRACT, TORT OR OTHERWISE, ARISING FROM, OUT OF OR IN CONNECTION WITH THE PRODUCT OR THE USE OR OTHER DEALINGS IN THE PRODUCT.
- This material is based upon work supported by the National Science Foundation under Grant No. 1715409 with the following title:
  SaTC: CORE: Small: Collaborative: GOALI: Detecting and Reconstructing Network Anomalies and Intrusions in Heavy Duty Vehicles.
  Any opinions, findings, and conclusions or recommendations expressed in this material are those of the author(s) and do not necessarily reflect the views of the National Science Foundation.
- Title:
- Subtitle:
- Date:
- Time:
- Revision:
- Sheet
- of
- File:
- Drawn with Altium
- (in symbol 74AHCT1G14 Inverter) Y=!A
- (in symbol 7805) DC/DC Converter
- (in symbol IRLML6344TRPbF) D; G; S
- (in symbol NCP1117 2.5V) NCP1117; Regulator
- (in symbol SN75HVD12D (3.3v RS485)) SN75HVD12D; RS485
- (in symbol Tantalum Cap_1) +

### Library data of the parts
C1 C4-C6 C8 C11 = Cap: as C7 on sheet DIY Teensy 3.6 rev 3e; Supplier 1: Digi-Key; Supplier Part Number 1: 399-6856-1-ND
C2 C28 = Tantalum Cap_1: 470µF 16V Aluminum Electrolytic Capacitors Radial, Can - SMD  5000 Hrs @ 105°C; Manufacturer: Panasonic Electronic Components; PartNumber: EEE-HA1C471P; Supplier 1: Digi-Key; Supplier Part Number 1: PCE4191TR-ND
C3 = Tantalum Cap_1: Aluminum Electrolytic Capacitors Radial, Can - SMD 5000 Hrs @ 105°C; Manufacturer: Panasonic Electronic Components; PartNumber: EEE-HC1H101P; Supplier 1: Digi-Key; Supplier Part Number 1: P19732CT-ND
C12 = Cap: 22µF ±20% 25V Ceramic Capacitor X5R 1206 (3216 Metric); Manufacturer: Murata Electronics North America; PartNumber: GRT31CR61E226ME01L; Supplier 1: Digi-Key; Supplier Part Number 1: 490-12451-1-ND
D3 D5 = Schottky Diode: Diode Schottky 1000V 1A Surface Mount DO-214AC (SMA); Manufacturer: Comchip Technology; Supplier 1: Digi-Key; Supplier Part Number 1: 641-1884-1-ND; PartNumber: ACURA107-HF
D11 = Diode: as D7 on sheet DIY Teensy 3.6 rev 3e; Supplier 1: Digi-Key; Supplier Part Number 1: CCS15S30L3FCT-ND
K1 = DPDT Relay: General Purpose Relay DPDT (2 Form C) Surface Mount; Manufacturer: KEMET; PartNumber: EE2-5NU-L; Supplier 1: Digi-Key; Supplier Part Number 1: 399-11017-1-ND
L6 = Ferrite Bead: as L1 on sheet DIY Teensy 3.6 rev 3e; Supplier 1: Digi-Key; Supplier Part Number 1: 490-17349-1-ND
LP1-LP4 = SLP3: Light Pipe Single Clear Rigid Round with Domed Top, 3mm Board Mount, Press Fit, Right Angle; Manufacturer: Bivar Inc.; PartNumber: SLP3-150-250-R; Supplier 1: Digi-Key; Supplier Part Number 1: 492-2517-ND
P3 SPI1 = Header 6: Header, 6-Pin
PTC1 = PTC: PTC RESTTBLE 0.75A 33V CHIP 1812; Manufacturer: Bel Fuse Inc.; PartNumber: 0ZCG0075BF2B; Supplier 1: Digi-Key; Supplier Part Number 1: 507-1765-1-ND
Q1 = IRLML6344TRPbF: IC INDCT LOAD DRVR AUTO SOT23; Manufacturer: ON Semiconductor; PartNumber: NUD3124LT1G; Alternative: None; Supplier 1: Digi-Key; Supplier Part Number 1: NUD3124LT1GOSCT-ND
R1 R4 R7 R22 = Chip Resistor: as R10 on sheet Teensy 3.6 with J1939 - Handheld Rev3e; Supplier 1: Digi-Key; Supplier Part Number 1: RHM4.7KAYCT-ND
R5 R6 R29 R30 = Chip Resistor: ±1% 0.1W, 1/10W Chip Resistor 0603 (1608 Metric) Automotive AEC-Q200, High Voltage Thick Film; Manufacturer: Rohm Semiconductor; PartNumber: KTR03EZPF47R0; Supplier 1: Digi-Key; Supplier Part Number 1: RHM47AYCT-ND
R14 R16 R17 R27 = Chip Resistor: as R8 on sheet Teensy 3.6 with J1939 - Handheld Rev3e; Supplier 1: Digi-Key; Supplier Part Number 1: RHM100KAYCT-ND
TVS1 = Transfeed: as TVS2 on sheet Teensy 3.6 with J1939 - Handheld Rev3e; Supplier 1: Digi-Key; Supplier Part Number 1: 478-2485-1-ND
U1 = 7805: 5V DC/DC Converter (7805 replacement); Manufacturer: Murata Power Solutions Inc.; PartNumber: OKI-78SR-5/1.5-W36H-C; Supplier 1: Digi-Key; Supplier Part Number 1: 811-2692-ND
U3 = 74AHCT1G14 Inverter: IC SCHMIT-TRIGG INV GATE SOT353; Manufacturer: Diodes Incorporated; PartNumber: 74AHCT1G14SE-7; Supplier 1: Digi-Key; Supplier Part Number 1: 74AHCT1G14SE-7DICT-ND
U4 = SN75HVD12D (3.3v RS485): IC RS485 TXRX 3/5V 8-SOIC; Manufacturer: Texas Instruments; PartNumber: SN75HVD08DR; Supplier 1: Digi-Key; Supplier Part Number 1: 296-37893-1-ND
U11 = ATML-ATWINC1500-MR210PA-28: SMARTCONNECT ATWINC1500B-MU-T MO; Manufacturer: Microchip Technologies; PartNumber: ATWINC1510-MR210PB1140; Supplier 1: Digi-Key; Supplier Part Number 1: ATWINC1510-MR210PB1140-ND
U13 = NCP1117 2.5V: Linear Voltage Regulator IC Positive Fixed Output 3.3V 1A SOT-223; Manufacturer: On Semiconductor; PartNumber: NCP1117LPST33T3G; Supplier 1: Digi-Key; Supplier Part Number 1: NCP1117LPST33T3GOSCT-ND
U15 = ATECC608A-MAHDA-T: Authentication Chip 8-UDFN _2x3_; Manufacturer: Microchip Technology; PartNumber: ATECC608A-MAHDA-T; Supplier 1: Digi-Key; Supplier Part Number 1: ATECC608A-MAHDA-TCT-ND
USB1 = USB-Rugged: USB - mini B USB 2.0 Receptacle Connector 5 Position Surface Mount, Right Angle; Through Hole; Manufacturer: Hirose; Supplier 1: Digi-Key; Supplier Part Number 1: H11589CT-ND; PartNumber: UX60SC-MB-5S8
Z1 = Zener - Bidirectional: TVS DIODE 20VWM 36.8VC SMA; Manufacturer: Micro Commercial Co; PartNumber: SMA6J24CA-TP; Supplier 1: Digi-Key; Supplier Part Number 1: SMA6J24CA-TPMSCT-ND

## Nets that join several sheets
3V3: DIY Teensy 3.6 rev 3e (19 pins), Teensy 3.6 with J1939 - Handheld Rev3e (11 pins), Additional Circuits - Handheld - Rev 3e (13 pins)
5V0: Teensy 3.6 with J1939 - Handheld Rev3e (U5.3 U8.3 U9.3), Additional Circuits - Handheld - Rev 3e (10 pins)
AGND: DIY Teensy 3.6 rev 3e (5 pins), Teensy 3.6 with J1939 - Handheld Rev3e (C17.1 C24.1 R24.2 R28.2)
CAN0RX: DIY Teensy 3.6 rev 3e (U6.J9), Teensy 3.6 with J1939 - Handheld Rev3e (U5.4)
CAN0TX: DIY Teensy 3.6 rev 3e (U6.K9), Teensy 3.6 with J1939 - Handheld Rev3e (U5.1)
CAN1RX: DIY Teensy 3.6 rev 3e (U6.K5), Teensy 3.6 with J1939 - Handheld Rev3e (U8.4)
CAN1TX: DIY Teensy 3.6 rev 3e (U6.M4), Teensy 3.6 with J1939 - Handheld Rev3e (U8.1)
CAN2H: Teensy 3.6 with J1939 - Handheld Rev3e (J1.3 U9.7), Additional Circuits - Handheld - Rev 3e (K1.3)
CAN2H/J1708+: Teensy 3.6 with J1939 - Handheld Rev3e (J1.15), Additional Circuits - Handheld - Rev 3e (K1.1)
CAN2L: Teensy 3.6 with J1939 - Handheld Rev3e (J1.4 U9.6), Additional Circuits - Handheld - Rev 3e (K1.6)
CAN2L/J1708-: Teensy 3.6 with J1939 - Handheld Rev3e (J1.14), Additional Circuits - Handheld - Rev 3e (K1.4)
GND: DIY Teensy 3.6 rev 3e (34 pins), Teensy 3.6 with J1939 - Handheld Rev3e (43 pins), Additional Circuits - Handheld - Rev 3e (34 pins)
J1708 RX: DIY Teensy 3.6 rev 3e (U6.A11 U6.B11), Additional Circuits - Handheld - Rev 3e (U4.1)
J1708 TX: DIY Teensy 3.6 rev 3e (U6.A9), Additional Circuits - Handheld - Rev 3e (U3.2)
LIN1 RX: DIY Teensy 3.6 rev 3e (U6.C4), Teensy 3.6 with J1939 - Handheld Rev3e (R10.1 U7.1)
LIN1 TX: DIY Teensy 3.6 rev 3e (U6.B4), Teensy 3.6 with J1939 - Handheld Rev3e (U7.4)
LIN !WAKE: DIY Teensy 3.6 rev 3e (U6.H9), Teensy 3.6 with J1939 - Handheld Rev3e (R8.1 U7.3)
LIN CS: DIY Teensy 3.6 rev 3e (U6.H10), Teensy 3.6 with J1939 - Handheld Rev3e (R9.1 U7.2)
RAW: Teensy 3.6 with J1939 - Handheld Rev3e (J1.8 R20.1 TVS3.1), Additional Circuits - Handheld - Rev 3e (D3.1)
Safe 12V: Teensy 3.6 with J1939 - Handheld Rev3e (C10.1 U2.5 U7.7), Additional Circuits - Handheld - Rev 3e (C1.2 C3.1 PTC1.2 U1.1)
SWCANRX: DIY Teensy 3.6 rev 3e (U6.D11), Teensy 3.6 with J1939 - Handheld Rev3e (U2.4)
SWCANTX: DIY Teensy 3.6 rev 3e (U6.D12), Teensy 3.6 with J1939 - Handheld Rev3e (U2.1)
USB D_N: DIY Teensy 3.6 rev 3e (U6.H2), Additional Circuits - Handheld - Rev 3e (R29.1)
USB D_P: DIY Teensy 3.6 rev 3e (U6.H1), Additional Circuits - Handheld - Rev 3e (R30.1)
A6_Sense: DIY Teensy 3.6 rev 3e (U6.A3), Teensy 3.6 with J1939 - Handheld Rev3e (U12.8)
A7_Measured: DIY Teensy 3.6 rev 3e (U6.L3), Teensy 3.6 with J1939 - Handheld Rev3e (C17.2 D9.2 R15.2 R24.1)
Blue: DIY Teensy 3.6 rev 3e (U6.K11), Teensy 3.6 with J1939 - Handheld Rev3e (D6.1)
BTTN1: DIY Teensy 3.6 rev 3e (U6.B1), Teensy 3.6 with J1939 - Handheld Rev3e (SW21.1 SW21.3)
BTTN2: DIY Teensy 3.6 rev 3e (U6.K10), Teensy 3.6 with J1939 - Handheld Rev3e (SW20.1 SW20.3)
CAN1SW: DIY Teensy 3.6 rev 3e (U6.A5), Additional Circuits - Handheld - Rev 3e (Q1.1 R14.2)
CHIP_EN: DIY Teensy 3.6 rev 3e (U6.K4), Additional Circuits - Handheld - Rev 3e (R17.1 U11.22)
CS1: DIY Teensy 3.6 rev 3e (U6.E12), Teensy 3.6 with J1939 - Handheld Rev3e (R33.1), Additional Circuits - Handheld - Rev 3e (U11.16)
CS_CAN: DIY Teensy 3.6 rev 3e (U6.B12), Teensy 3.6 with J1939 - Handheld Rev3e (R32.1 U14.13)
Debug RX: DIY Teensy 3.6 rev 3e (U6.B9), Additional Circuits - Handheld - Rev 3e (P3.4 U11.19)
Debug TX: DIY Teensy 3.6 rev 3e (U6.C9), Additional Circuits - Handheld - Rev 3e (P3.5 U11.14)
Green: DIY Teensy 3.6 rev 3e (U6.A4), Teensy 3.6 with J1939 - Handheld Rev3e (D1.1)
M0: DIY Teensy 3.6 rev 3e (U6.D10), Teensy 3.6 with J1939 - Handheld Rev3e (U2.2)
M1: DIY Teensy 3.6 rev 3e (U6.C12), Teensy 3.6 with J1939 - Handheld Rev3e (U2.3)
MISO1: DIY Teensy 3.6 rev 3e (U6.E9), Additional Circuits - Handheld - Rev 3e (SPI1.4 U11.17)
MOSI1: DIY Teensy 3.6 rev 3e (U6.E10), Additional Circuits - Handheld - Rev 3e (SPI1.5 U11.15)
NetU6_B7: DIY Teensy 3.6 rev 3e (U6.B7), Teensy 3.6 with J1939 - Handheld Rev3e (U14.4)
NetU6_C7: DIY Teensy 3.6 rev 3e (U6.C7), Teensy 3.6 with J1939 - Handheld Rev3e (U14.3)
NetU6_D7: DIY Teensy 3.6 rev 3e (U6.D7), Additional Circuits - Handheld - Rev 3e (U11.11)
nINT0: DIY Teensy 3.6 rev 3e (U6.F1), Teensy 3.6 with J1939 - Handheld Rev3e (U14.9)
nINT1: DIY Teensy 3.6 rev 3e (U6.G4), Teensy 3.6 with J1939 - Handheld Rev3e (U14.8)
RAW_Measured: DIY Teensy 3.6 rev 3e (U6.L4), Teensy 3.6 with J1939 - Handheld Rev3e (C24.2 D10.2 R25.2 R28.1)
RAW_Sense: DIY Teensy 3.6 rev 3e (U6.A2), Teensy 3.6 with J1939 - Handheld Rev3e (U12.6)
RED: DIY Teensy 3.6 rev 3e (U6.D4), Teensy 3.6 with J1939 - Handheld Rev3e (D2.1), Additional Circuits - Handheld - Rev 3e (SPI1.2)
RX1: DIY Teensy 3.6 rev 3e (U6.L11), Teensy 3.6 with J1939 - Handheld Rev3e (P2.3 UART1.2)
SCK: DIY Teensy 3.6 rev 3e (U6.D8), Teensy 3.6 with J1939 - Handheld Rev3e (U14.10)
SCK1: DIY Teensy 3.6 rev 3e (U6.E11), Additional Circuits - Handheld - Rev 3e (SPI1.3 U11.18)
SCL0: DIY Teensy 3.6 rev 3e (U6.G12), Teensy 3.6 with J1939 - Handheld Rev3e (I2C.2), Additional Circuits - Handheld - Rev 3e (R22.2 U15.6)
SDA0: DIY Teensy 3.6 rev 3e (U6.G11), Teensy 3.6 with J1939 - Handheld Rev3e (I2C.3), Additional Circuits - Handheld - Rev 3e (R1.2 U15.5)
SDI: DIY Teensy 3.6 rev 3e (U6.C8), Teensy 3.6 with J1939 - Handheld Rev3e (U14.11)
SDO: DIY Teensy 3.6 rev 3e (U6.B8), Teensy 3.6 with J1939 - Handheld Rev3e (U14.12)
Silent 0: DIY Teensy 3.6 rev 3e (U6.J11), Teensy 3.6 with J1939 - Handheld Rev3e (R11.1 U5.8)
Silent 1: DIY Teensy 3.6 rev 3e (U6.H11), Teensy 3.6 with J1939 - Handheld Rev3e (R12.1 U8.8)
Silent 2: DIY Teensy 3.6 rev 3e (U6.H12), Teensy 3.6 with J1939 - Handheld Rev3e (R13.1 U9.8)
TX1: DIY Teensy 3.6 rev 3e (U6.L10), Teensy 3.6 with J1939 - Handheld Rev3e (UART1.3)
WIFI IRQ: DIY Teensy 3.6 rev 3e (U6.A12), Additional Circuits - Handheld - Rev 3e (U11.13)
Yellow: DIY Teensy 3.6 rev 3e (U6.A1), Teensy 3.6 with J1939 - Handheld Rev3e (D4.1)